# EAGLE design DFTT (EAGLE 7.4.0)

## Sheet 1 of 2
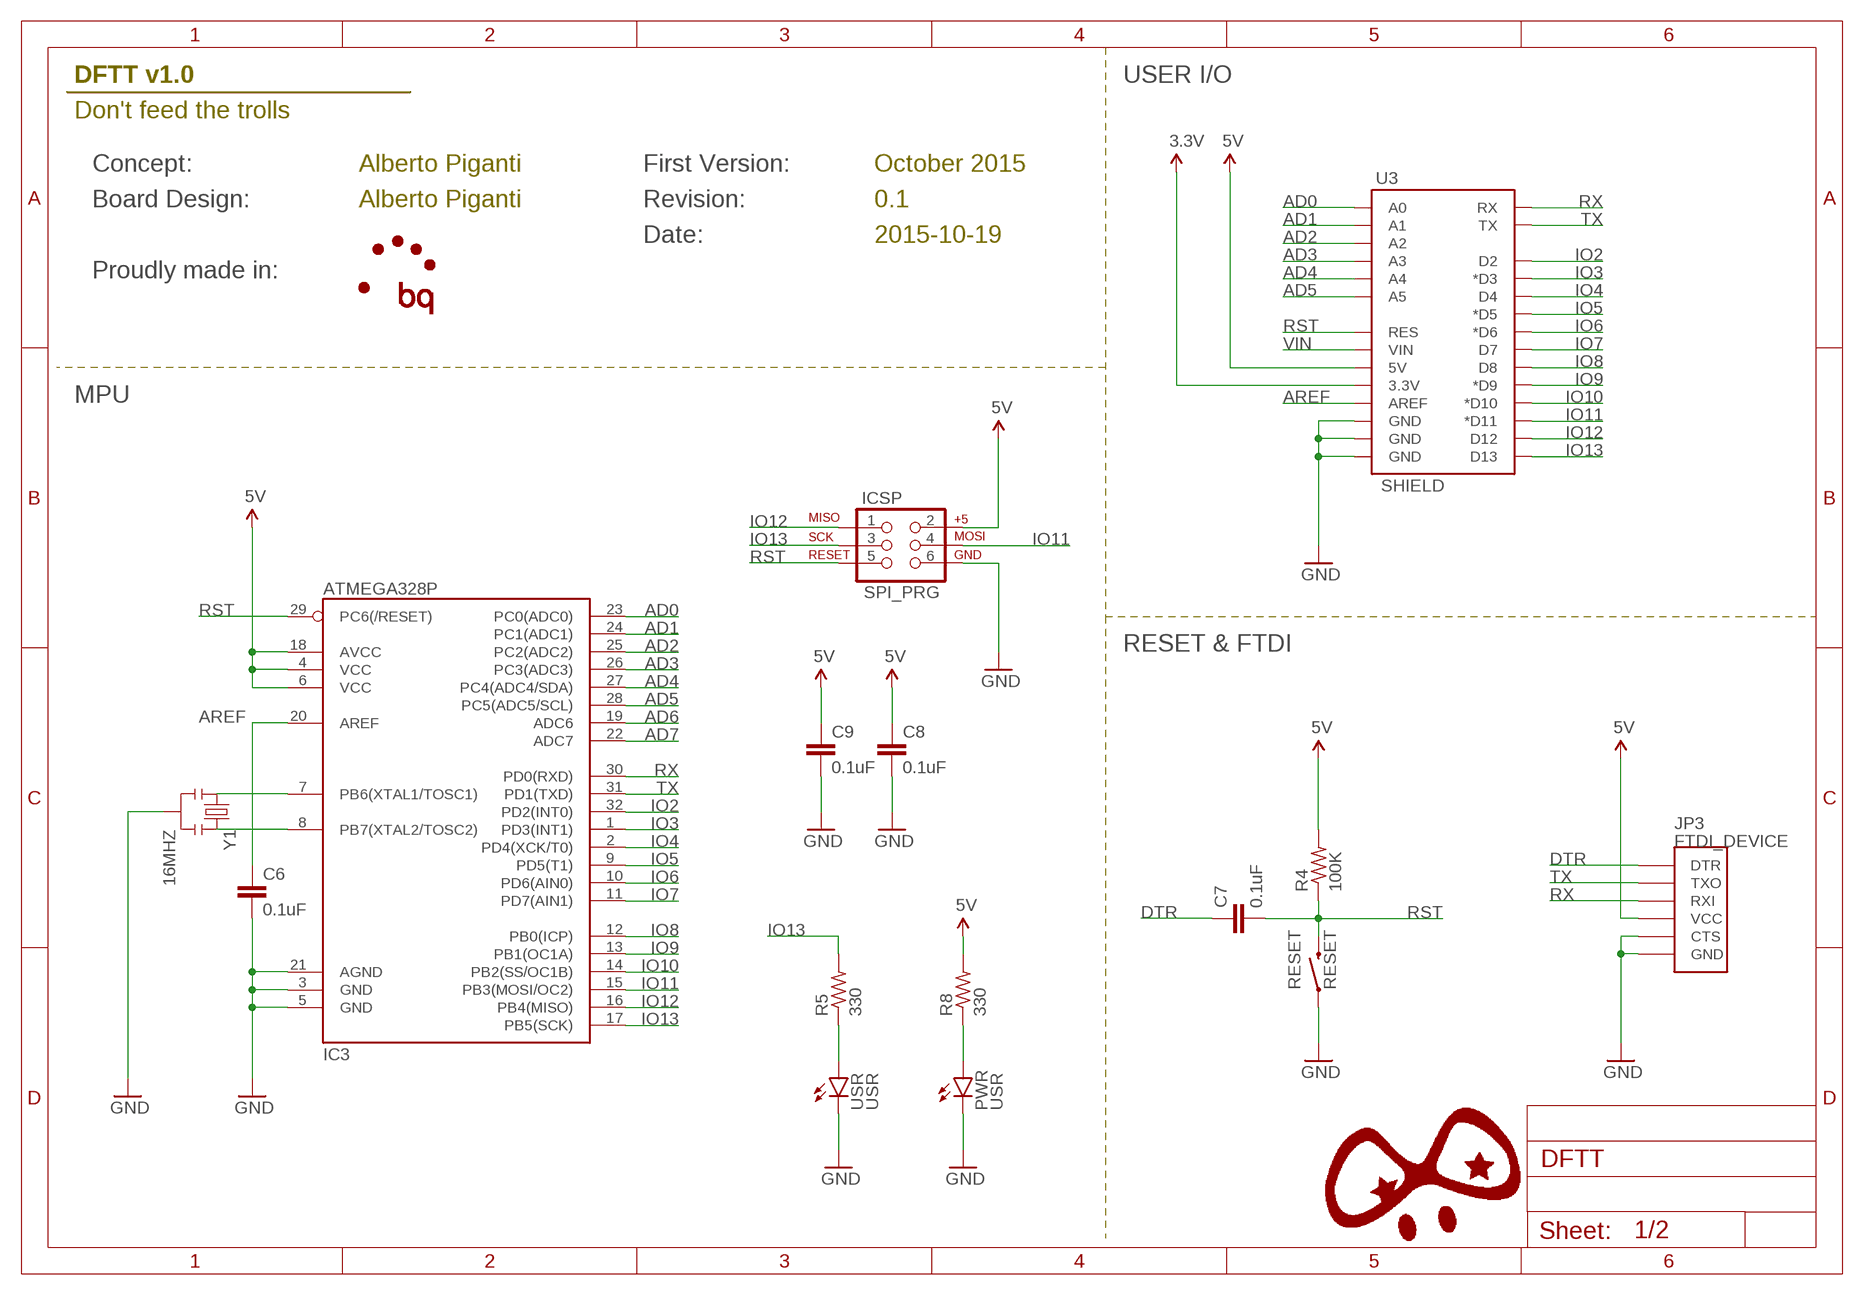
[diagram p0: schematic, sheet 1]

### Parts
C6  0.1uF  C-EUC0603  [C0603]
C7  0.1uF  C-EUC0603  [C0603]
C8  0.1uF  C-EUC0603  [C0603]
C9  0.1uF  C-EUC0603  [C0603]
IC3  ATMEGA328P  ATMEGA328_SMT  [TQFP32-08]
ICSP  SPI_PRG  AVR_SPI_PRG_6NS  [2X3-NS]
JP3  FTDI_DEVICE  [FTDI_DEVICE_SIDE]
PWR  USR  LED0603  [LED-0603]
R4  100K  R-US_R0603  [R0603]
R5  330  R-US_R0603  [R0603]
R8  330  R-US_R0603  [R0603]
RESET  RESET  SWITCH-MOMENTARY-2SMD-1101NE  [TACTILE-SWITCH-1101NE]
U3  SHIELD  ARDUINO_SHIELDNO_SILK  [DUEMILANOVE_VIAS]
USR  USR  LED0603  [LED-0603]
Y1  16MHZ  RESONATOR16MHZ  [RESONATOR-SMD]

### Nets
3.3V: U3.3.3V ; also sheet 2
5V: C8.1 C9.1 IC3.4(VCC) IC3.6(VCC) IC3.18(AVCC) ICSP.2 JP3.P$4(VCC) R4.2 R8.2 U3.5V ; also sheet 2
AD0: IC3.23(PC0(ADC0)) U3.A0
AD1: IC3.24(PC1(ADC1)) U3.A1
AD2: IC3.25(PC2(ADC2)) U3.A2
AD3: IC3.26(PC3(ADC3)) U3.A3
AD4: IC3.27(PC4(ADC4/SDA)) U3.A4
AD5: IC3.28(PC5(ADC5/SCL)) U3.A5
AD6: IC3.19(ADC6)
AD7: IC3.22(ADC7)
AREF: C6.1 IC3.20(AREF) U3.AREF
DTR: C7.1 JP3.P$1(DTR)
GND: C6.2 C8.2 C9.2 IC3.3(GND) IC3.5(GND) IC3.21(AGND) ICSP.6 JP3.P$5(CTS) JP3.P$6(GND) PWR.C RESET.1 U3.GND@0(GND) U3.GND@1(GND) U3.GND@2(GND) USR.C Y1.2 ; also sheet 2
IO2: IC3.32(PD2(INT0)) U3.D2
IO3: IC3.1(PD3(INT1)) U3.D3(*D3) ; also sheet 2
IO4: IC3.2(PD4(XCK/T0)) U3.D4
IO5: IC3.9(PD5(T1)) U3.D5(*D5) ; also sheet 2
IO6: IC3.10(PD6(AIN0)) U3.D6(*D6)
IO7: IC3.11(PD7(AIN1)) U3.D7
IO8: IC3.12(PB0(ICP)) U3.D8
IO9: IC3.13(PB1(OC1A)) U3.D9(*D9) ; also sheet 2
IO10: IC3.14(PB2(SS/OC1B)) U3.D10(*D10) ; also sheet 2
IO11: IC3.15(PB3(MOSI/OC2)) ICSP.4 U3.D11(*D11) ; also sheet 2
IO12: IC3.16(PB4(MISO)) ICSP.1 U3.D12
IO13: IC3.17(PB5(SCK)) ICSP.3 R5.2 U3.D13
N$9: R5.1 USR.A
N$10: PWR.A R8.1
N$31: IC3.7(PB6(XTAL1/TOSC1)) Y1.1
N$32: IC3.8(PB7(XTAL2/TOSC2)) Y1.3
RST: C7.2 IC3.29(PC6(/RESET)) ICSP.5 R4.1 RESET.2 U3.RES
RX: IC3.30(PD0(RXD)) JP3.P$3(RXI) U3.RX
TX: IC3.31(PD1(TXD)) JP3.P$2(TXO) U3.TX
VIN: U3.VIN ; also sheet 2

### Notes on the sheet
- DFTT v1.0 | USER I/O
- Don't feed the trolls
- Concept: | Alberto Piganti | First Version: | October 2015
- Board Design: | Alberto Piganti | Revision: | 0.1
- Date: | 2015-10-19
- Proudly made in:
- MPU
- RESET & FTDI

## Sheet 2 of 2
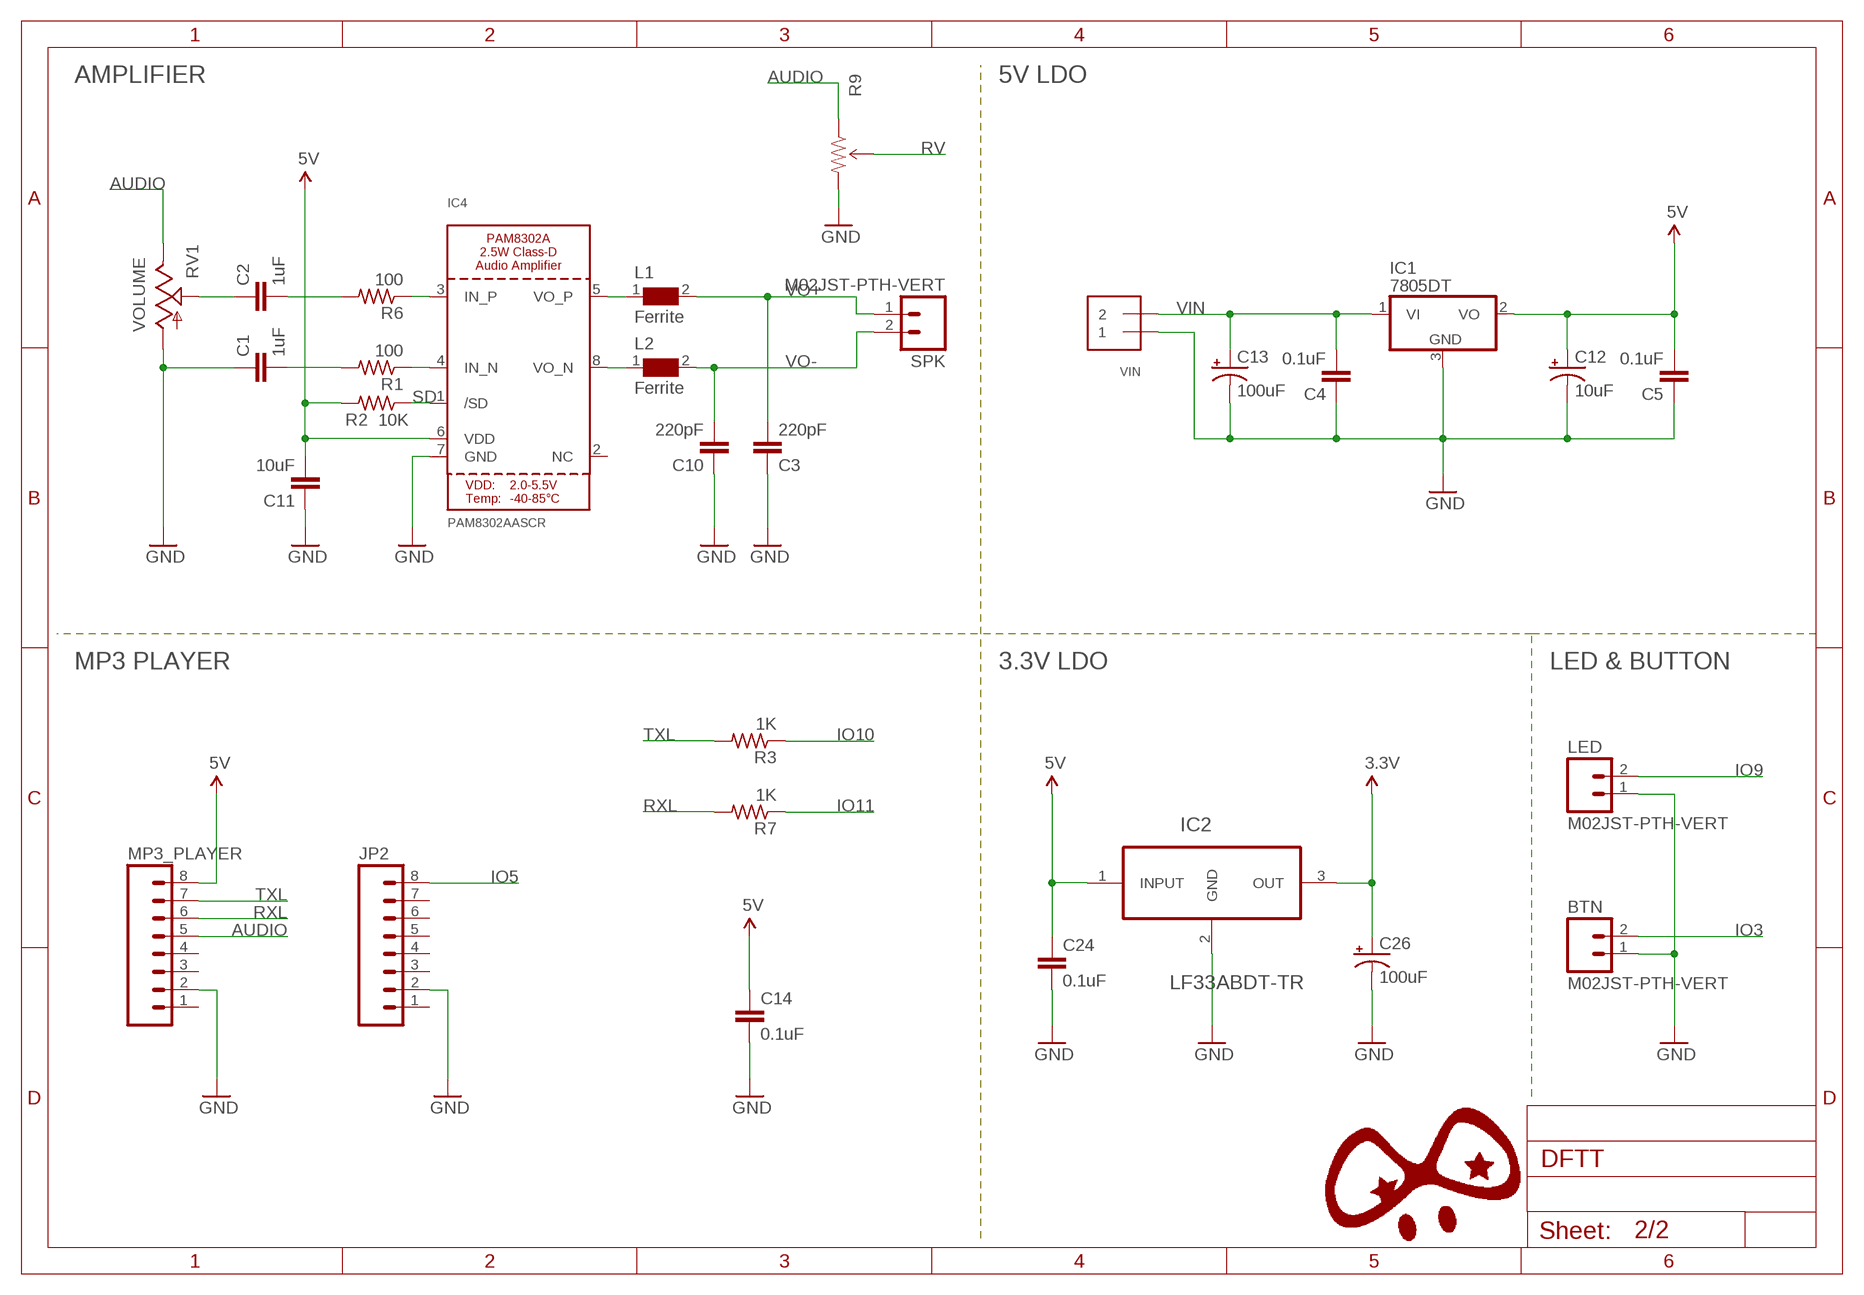
[diagram p1: schematic, sheet 2]

### Parts
BTN  M02JST-PTH-VERT  [JST-2-PTH-VERT]
C1  1uF  C-EUC0603  [C0603]
C2  1uF  C-EUC0603  [C0603]
C3  220pF  C-EUC0603  [C0603]
C4  0.1uF  C-EUC0603  [C0603]
C5  0.1uF  C-EUC0603  [C0603]
C10  220pF  C-EUC0603  [C0603]
C11  10uF  C-EUC0603  [C0603]
C12  10uF  CAP_POLD  [PANASONIC_D]
C13  100uF  CAP_POLD  [PANASONIC_D]
C14  0.1uF  CAP1210  [1210]
C24  0.1uF  CAP1210  [1210]
C26  100uF  CAP_POLD  [PANASONIC_D]
IC1  7805DT  [TO252]
IC2  LF33ABDT-TR  [TO228P972X240-3N]
IC4  PAM8302AASCR  AUDIOAMP_PAM8302A  [MSOP8_0.65MM]
JP2  M08LOCK  [1X08_LOCK]
L1  Ferrite  FERRITE-74279261_0603  [0603]
L2  Ferrite  FERRITE-74279261_0603  [0603]
LED  M02JST-PTH-VERT  [JST-2-PTH-VERT]
MP3_PLAYER  M08LOCK  [1X08_LOCK]
R1  100  R-US_R0603  [R0603]
R2  10K  R-US_R0603  [R0603]
R3  1K  R-US_R0603  [R0603]
R6  100  R-US_R0603  [R0603]
R7  1K  R-US_R0603  [R0603]
R9  TRIMPOT3362U-2  [3362U-2]
RV1  VOLUME  POTTRIM  [TRIM_POT]
SPK  M02JST-PTH-VERT  [JST-2-PTH-VERT]
VIN  TERMBLOCK_1X2  [TERMBLOCK_1X2-3.5MM]

### Nets
3.3V: C26.+ IC2.3(OUT) ; also sheet 1
5V: C5.2 C11.2 C12.+ C14.1 C24.1 IC1.2(VO) IC2.1(INPUT) IC4.6(VDD) MP3_PLAYER.8 R2.2 ; also sheet 1
AUDIO: MP3_PLAYER.5 R9.1(CCW) RV1.2(E)
GND: BTN.1 C1.1 C3.1 C4.1 C5.1 C10.1 C11.1 C12.- C13.- C14.2 C24.2 C26.- IC1.3(GND) IC2.2(GND) IC4.7(GND) JP2.2 LED.1 MP3_PLAYER.2 R9.3(CW) RV1.3(A) VIN.1 ; also sheet 1
IO3: BTN.2 ; also sheet 1
IO5: JP2.8 ; also sheet 1
IO9: LED.2 ; also sheet 1
IO10: R3.1 ; also sheet 1
IO11: R7.1 ; also sheet 1
N$1: IC4.4(IN_N) R1.1
N$2: IC4.3(IN_P) R6.1
N$3: C2.2 R6.2
N$4: C1.2 R1.2
N$5: IC4.8(VO_N) L2.1
N$6: IC4.5(VO_P) L1.1
RV: C2.1 R9.2(WIPER) RV1.1(S)
RXL: MP3_PLAYER.6 R7.2
SD: IC4.1(/SD) R2.1
TXL: MP3_PLAYER.7 R3.2
VIN: C4.2 C13.+ IC1.1(VI) VIN.2 ; also sheet 1
VO+: C3.2 L1.2 SPK.1
VO-: C10.2 L2.2 SPK.2
Unconnected: IC4.2(NC) JP2.1 JP2.3 JP2.4 JP2.5 JP2.6 JP2.7 MP3_PLAYER.1 MP3_PLAYER.3 MP3_PLAYER.4

### Notes on the sheet
- AMPLIFIER | 5V LDO
- MP3 PLAYER | 3.3V LDO | LED & BUTTON

## Library data of the parts
BTN LED SPK = SparkFun-Connectors:M02: Standard 2-pin 0.1" header. Use with - straight break away headers ( PRT-00116) - right angle break away headers (PRT-00553) - swiss pins (PRT-00743) - machine pins (PRT-00117) - female headers (PRT-00115) Molex polarized connector foot print use with: PRT-08233 with associated crimp pins and housings. 2.54_SCREWTERM for use with PRT-10571. 3.5mm Screw Terminal footprints for PRT-08084 5mm Screw Terminal footprints for use with PRT-08432
C1-C11 = resistor:C-EU: CAPACITOR, European symbol
C12 C13 C26 = SparkFun-Capacitors:CAP_POL: Capacitor Polarized These are standard SMD and PTH capacitors. Normally 10uF, 47uF, and 100uF in electrolytic and tantalum varieties. Always verify the external diameter of the through hole cap, it varies with capacity, voltage, and manufacturer. The EIA devices should be standard.
C14 C24 = SparkFun-Capacitors:CAP: Capacitor Standard 0603 ceramic capacitor, and 0.1" leaded capacitor.
IC1 = linear:78*: Positive VOLTAGE REGULATOR Source: http://cache.national.com/ds/LM/LM78L05.pdf http://www.fairchildsemi.com/ds/LM/LM7805.pdf
IC2 = STM-LF33ABDT-TR:LF33ABDT-TR: LDO, 0.45VDO, 1A, 3.3V, 1%, 3TO252; MPN: LF33ABDT-TR; OC_FARNELL: 2253503; OC_NEWARK: 26M0226; PACKAGE: DPAK; SUPPLIER: STMicroelectronics
IC3 = SparkFun-DigitalIC:ATMEGA328_SMT: 32-Pin Atmega328 part Commonly used on Arduino compatible boards Available in QFP and QFN packages TQFP is IC-09069 QFN is non-stock; PROD_ID: IC-09069
IC4 = microbuilder:AUDIOAMP_PAM8302A: PAM8302A - 2.5W Class-D Mono Audio Amplifier MSOP8 = PAM8302AASCR
ICSP = SparkFun-Connectors:AVR_SPI_PRG_6: AVR ISP 6 Pin This is the reduced ISP connector for AVR programming. Common on Arduino. This footprint will take up less PCB space and can be used with a 10-pin to 6-pin adapter such as SKU: BOB-08508 **Special note about "TEST_POINT" package. The stop mask is on the top side, so if you want your programming test points to be on the bottom of your board, make sure to place this package on the bottom side of the board. This also ensure that the orientation to program from the bottom side will be correct.
JP2 MP3_PLAYER = SparkFun-Connectors:M08: Header 8 Standard 8-pin 0.1" header. Use with straight break away headers (SKU : PRT-00116), right angle break away headers (PRT-00553), swiss pins (PRT-00743), machine pins (PRT-00117), and female headers (PRT-00115).
JP3 = SparkFun-Connectors:FTDI_DEVICE: Connector which mates to FTDI basic or FTDI cable.
L1 L2 = Honey_v2:FERRITE: SMD EMI Suppression Ferrite Beads; MPN: 74279261; OC_FARNELL: 1635684; OC_NEWARK: 08P2431; PACKAGE: IND-0603; SUPPLIER: Wuerth Elektronik
PWR USR = SparkFun-LED:LED: LEDs Standard schematic elements and footprints for 5mm, 3mm, 1206, and 0603 sized LEDs. 5mm - Spark Fun Electronics SKU : COM-00529 (and others)
R1-R8 = resistor:R-US_: RESISTOR, American symbol
R9 = SparkFun-Electromechanical:TRIMPOT: Various small potentiometers for "set-and-forget" applications
RESET = SparkFun-Electromechanical:SWITCH-MOMENTARY-2: Various NO switches- pushbuttons, reed, etc; PROD_ID: SWCH-00815
RV1 = SparkFun-Electromechanical:POT
U3 = SparkFun-Boards:ARDUINO_SHIELD: Arduino shield footprint
VIN = microbuilder:TERMBLOCK_1X2: 3.5mm Terminal block http://www.ladyada.net/library/pcb/eaglelibrary.html
Y1 = SparkFun-FreqCtrl:RESONATOR: Resonator Small SMD resonator. Used, eg, on the Arduino Pro/ Pro Mini boards. 8MHz- XTAL-08895 16MHz- XTAL-08900; PROD_ID: XTAL-08900

## Board
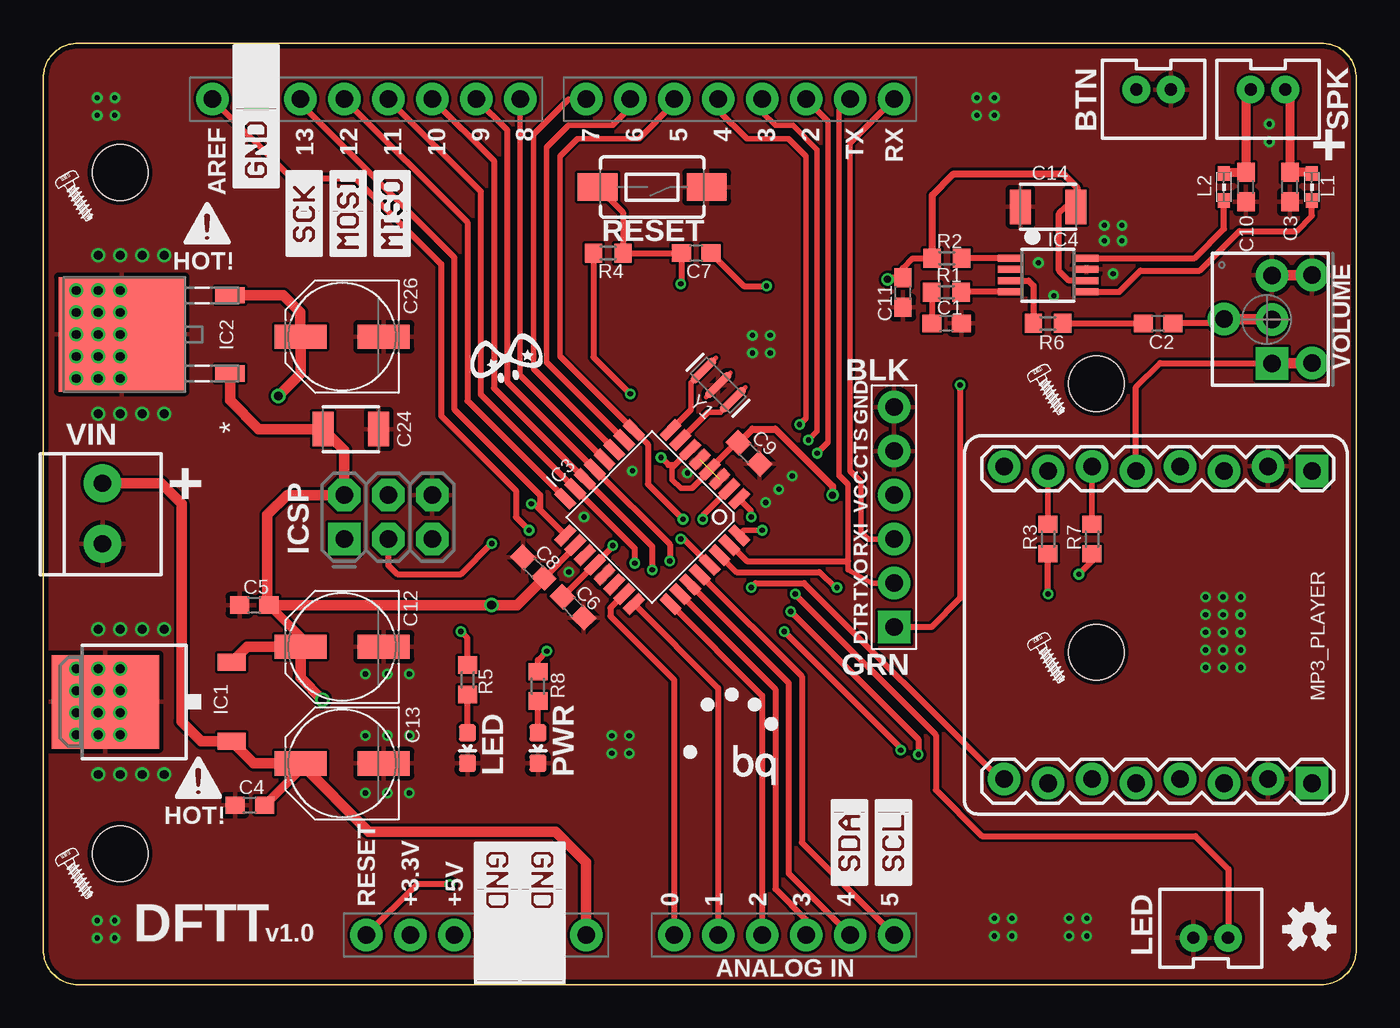
[diagram p2: board, top side]
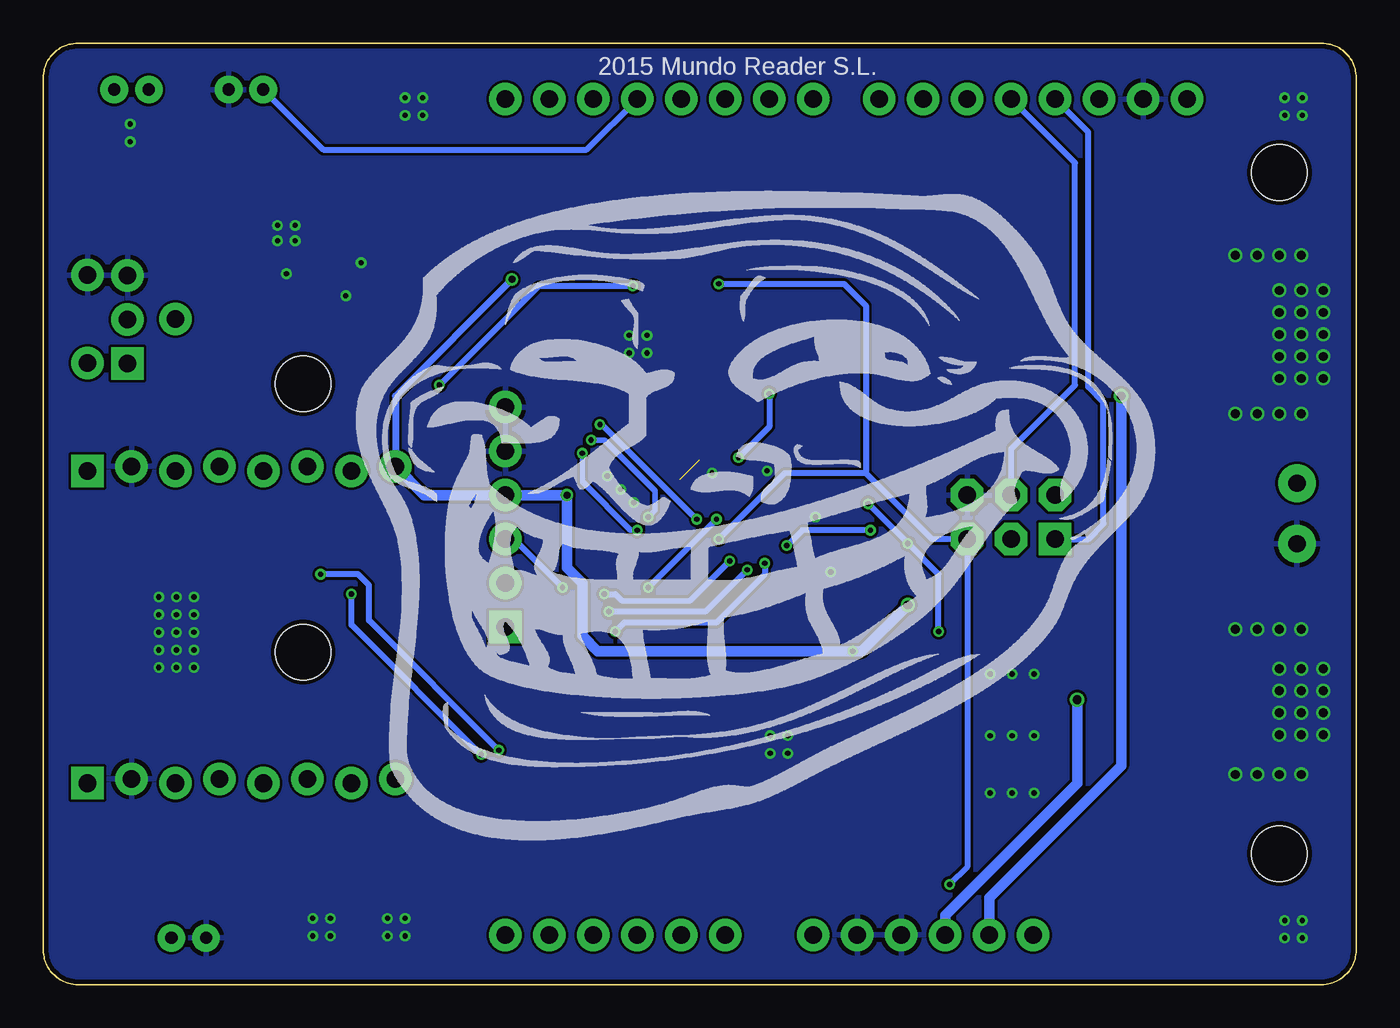
[diagram p3: board, bottom side, seen from below]

Size 75.82 x 54.34 mm. Coordinates in mm from the lower left corner, seen from the top.
Outline: 75.82,1.86 75.81,1.73 75.78,1.6 75.76,1.47 75.72,1.34 75.62,1.1 75.55,0.99 75.48,0.88 75.41,0.78 75.33,0.68 75.15,0.5 75.05,0.41 74.94,0.34 74.83,0.27 74.72,0.21 74.48,0.11 74.36,0.07 74.23,0.04 74.1,0.01 73.96,0 1.86,0 1.73,0.01 1.6,0.04 1.47,0.07 1.34,0.11 1.1,0.21 0.99,0.27 0.88,0.34 0.78,0.41 0.68,0.5 0.5,0.68 0.41,0.78 0.34,0.88 0.27,0.99 0.21,1.1 0.11,1.34 0.07,1.47 0.04,1.6 0.01,1.73 0,1.86 0,52.48 0.01,52.61 0.04,52.74 0.07,52.87 0.11,53 0.21,53.23 0.27,53.35 0.34,53.45 0.41,53.56 0.5,53.66 0.68,53.84 0.78,53.92 0.88,54 0.99,54.07 1.1,54.13 1.34,54.23 1.47,54.27 1.6,54.3 1.73,54.32 1.86,54.34 73.96,54.34 74.1,54.32 74.23,54.3 74.36,54.27 74.48,54.23 74.72,54.13 74.83,54.07 74.94,54 75.05,53.92 75.15,53.84 75.33,53.66 75.41,53.56 75.48,53.45 75.55,53.35 75.62,53.23 75.72,53 75.76,52.87 75.78,52.74 75.81,52.61 75.82,52.48 75.82,1.86
Copper layers (1*16): Top 0.035mm / dielectric 1.5mm / Bottom 0.035mm
Design rules "pighixxx_CAM_DRC_V1.0": minimum track width 6mil, minimum drill 12mil, track to track 6mil, track to pad 6mil, pad to pad 6mil, via to via 6mil, smd to smd 0mil, copper to edge 10mil, drill to drill 10mil, minimum pad ring 10mil, minimum via ring 6mil, stop-mask expansion 2mil, vias tented up to drill 100mil, thermal gap 10mil
Holes 3.2 mm at 4.43,46.88 4.43,7.56 60.82,34.69 60.82,19.19

### Footprints (pad centres in the part's own frame; a part is rotated, then mirrored left to right if it is on the bottom)
JST-2-PTH-VERT = drill 0.7 pad 1.6: 1 -1,-0.55; 2 1,-0.55
C0603 = smd 1.1 x 1: 1 -0.85,0; 2 0.85,0
PANASONIC_D = smd 3 x 1.4: + 2.4,0; - -2.4,0
1210 = smd 1.2 x 2: 1 -1.6,0; 2 1.6,0
TO252 = smd 1 x 1.6: 1 -2.28,-4.8; 2 2.28,-4.8 | smd 5.4 x 6.2: 3 0,2.5
TO228P972X240-3N = smd 0.94 x 1.702: 1 -2.261,-6.096; 3 2.261,-6.096 | smd 6.604 x 7.315: 2 0,0.152
TQFP32-08 = smd 1.27 x 0.559: 1 -4.293,2.8; 2 -4.293,2; 3 -4.293,1.2; 4 -4.293,0.4; 5 -4.293,-0.4; 6 -4.293,-1.2; 7 -4.293,-2; 8 -4.293,-2.8; 17 4.293,-2.8; 18 4.293,-2; 19 4.293,-1.2; 20 4.293,-0.4; 21 4.293,0.4; 22 4.293,1.2; 23 4.293,2; 24 4.293,2.8 | smd 0.559 x 1.27: 9 -2.8,-4.293; 10 -2,-4.293; 11 -1.2,-4.293; 12 -0.4,-4.293; 13 0.4,-4.293; 14 1.2,-4.293; 15 2,-4.293; 16 2.8,-4.293; 25 2.8,4.293; 26 2,4.293; 27 1.2,4.293; 28 0.4,4.293; 29 -0.4,4.293; 30 -1.2,4.293; 31 -2,4.293; 32 -2.8,4.293
MSOP8_0.65MM = smd 0.4 x 1.4: 1 -0.975,-2.2; 2 -0.325,-2.2; 3 0.325,-2.2; 4 0.975,-2.2; 5 0.975,2.2; 6 0.325,2.2; 7 -0.325,2.2; 8 -0.975,2.2
2X3-NS = drill 1.016 pad 1.88 square: 1 -2.54,-1.27 | drill 1.016 pad 1.88 octagon: 2 -2.54,1.27; 3 0,-1.27; 4 0,1.27; 5 2.54,-1.27; 6 2.54,1.27
1X08_LOCK = drill 1.016 pad 1.88 square: 1 0,0.127 | drill 1.016 pad 1.88: 2 2.54,-0.127; 3 5.08,0.127; 4 7.62,-0.127; 5 10.16,0.127; 6 12.7,-0.127; 7 15.24,0.127; 8 17.78,-0.127
FTDI_DEVICE_SIDE = drill 1.016 pad 1.88 square: P$1 -6.35,0 | drill 1.016 pad 1.88: P$2 -3.81,0; P$3 -1.27,0; P$4 1.27,0; P$5 3.81,0; P$6 6.35,0
0603 = smd 0.85 x 0.7: 1 -0.775,0; 2 0.775,0
LED-0603 = smd 1 x 1: A 0,-0.877; C 0,0.877
R0603 = smd 1 x 1.1: 1 -0.85,0; 2 0.85,0
3362U-2 = drill 1.016 pad 1.88 square: 1 -2.54,-0.305 | drill 1.016 pad 1.88: 2 0,-0.305; 3 2.54,-0.305
TACTILE-SWITCH-1101NE = smd 2.3 x 1.6: 1 -3.15,0; 2 3.15,0
TRIM_POT = drill 1 pad 1.88: 1 5.08,0; 2 0,2.54; 3 0,-2.54
DUEMILANOVE_VIAS = drill 1.016 pad 1.88: 3.3V 50.8,13.97; 5V 50.8,16.51; A0 50.8,29.21; A1 50.8,31.75; A2 50.8,34.29; A3 50.8,36.83; A4 50.8,39.37; A5 50.8,41.91; AREF 2.54,2.54; D2 2.54,36.83; D3 2.54,34.29; D4 2.54,31.75; D5 2.54,29.21; D6 2.54,26.67; D7 2.54,24.13; D8 2.54,20.32; D9 2.54,17.78; D10 2.54,15.24; D11 2.54,12.7; D12 2.54,10.16; D13 2.54,7.62; GND@0 50.8,19.05; GND@1 50.8,21.59; GND@2 2.54,5.08; RES 50.8,11.43; RX 2.54,41.91; TX 2.54,39.37; VIN 50.8,24.13
TERMBLOCK_1X2-3.5MM = drill 1 pad 2.184: 1 1.8,0; 2 -1.7,0
RESONATOR-SMD = smd 0.45 x 1.905: 1 -1.2,0; 2 0,0; 3 1.2,0

### Placement (x,y rotation side)
BTN  64.12,51.12 180 top
C1  52.16,38.17 180 top
C2  64.38,38.17 180 top
C3  72,46.04 90 top
C4  11.93,10.35 0 top
C5  12.18,21.91 0 top
C6  30.6,21.78 315 top
C7  37.71,42.23 180 top
C8  28.31,24.07 135 top
C9  40.76,30.67 315 top
C10  69.46,46.04 90 top
C11  49.65,39.94 90 top
C12  17.26,19.5 180 top
C13  17.26,12.77 180 top
C14  58.03,44.9 180 top
C24  17.77,32.07 0 top
C26  17.26,37.4 180 top
IC1  6.08,16.32 90 top
IC2  4.69,37.53 90 top
IC3  35.17,26.99 225 top
IC4  58.03,40.96 270 top
ICSP  19.93,26.99 0 top
JP2  73.27,11.75 180 top
JP3  49.14,26.99 90 top
L1  73.27,46.04 90 top
L2  68.19,46.04 90 top
LED  67.43,3.24 0 top
LOGO3  OSHW-LOGOS  [OSHW-LOGO-S]  73.12,3.19 0 top
MP3_PLAYER  73.27,29.78 180 top
PWR  28.56,13.65 180 top
R1  52.16,39.97 180 top
R2  52.19,41.92 180 top
R3  58.03,25.72 90 top
R4  32.63,42.23 180 top
R5  24.5,17.59 90 top
R6  58.03,38.17 0 top
R7  60.57,25.72 90 top
R8  28.56,17.21 90 top
R9  70.65,38.39 90 top
RESET  35.17,46.04 180 top
RV1  73.27,38.42 180 top
SPK  70.73,51.12 180 top
U3  7.23,53.66 270 top
U$1  [S_KICIK_GND_2]  10.4,45.99 0 top
U$2  [S_KICIK_GND_2]  28.11,8.24 180 top
U$3  [S_KICIK_GND_2]  30.7,8.24 180 top
U$4  [S_SCL]  48.12,5.78 0 top
U$5  [S_SDA]  45.58,5.78 0 top
U$6  [TROLLFACE]  60.06,5.53 0 bottom
U$7  [S_ATTENTION]  7.48,10.61 0 top
U$8  [S_MISO]  19.17,42.1 0 top
U$9  [S_MOSI]  16.63,42.1 0 top
U$10  [S_SCK]  14.09,42.1 0 top
U$11  [S_ATTENTION]  7.99,42.61 0 top
U$12  [SCREW]  1.39,44.9 0 top
U$13  [SCREW]  1.39,5.78 0 top
U$14  [SCREW]  57.52,18.23 0 top
U$15  [SCREW]  57.52,33.72 0 top
U$22  [BQ_LOGO_SMALL]  36.97,11.52 0 top
U$23  [PIGHIXXX_LOGO]  24.68,34.74 0 top
USR  24.5,13.65 180 top
VIN  3.42,27.24 270 top
Y1  38.98,34.61 135 top

### Tracks (layer width: path | path; a pad name or v marks a point on that pad's centre or on a via)
3.3V  (via drill 0.51)
  Top 0.61: IC2.3 13.86,39.79 14.85,38.8 14.85,37.42 C26.+ 14.86,35.26 v13.58,33.97
  Bottom 0.61: v13.58,33.97 13.58,12.64 21.2,5.02 U3.3.3V
5V  (via drill 0.3, 0.41, 0.51)
  Top 0.305: IC3.18 30.72,25.27 C8.1 | C9.1 40.02,31.27 IC3.4 38.49,29.67 37.45,28.64 36.82,28.64 36.31,29.15 36.31,29.83 36.48,30 IC3.6
  Top 0.356: C11.2 49.65,41.37 50.2,41.92 R2.2 | IC4.6 59.24,40.63 58.66,41.21 58.66,44.52 59.04,44.9 C14.1 | R4.2 31.78,36.22 v33.9,34.1 | v35.68,30.42 36.1,30 36.48,30 | R8.2 28.56,18.73 v29.07,19.24
  Top 0.406: C9.1 40.95,32.07 42.28,32.07 45.58,28.77 v45.58,28.26 | v48.76,40.71 48.84,40.79 C11.2 | R2.2 51.34,45.57 52.57,46.8 58.92,46.8 59.68,46.04 59.68,44.95 C14.1
  Top 0.508: C5.2 14.86,20.08 C12.+
  Top 0.61: IC1.2 11.78,19.5 C12.+ 14.86,17.71 v16.12,16.45 | C8.1 27.35,21.91 v25.9,21.91 C5.2 12.94,22 12.94,27.12 14.09,28.26 ICSP.2 17.39,30.85 C24.1 12.43,32.07 10.78,33.72 IC2.1
  Bottom 0.356: v33.9,34.1 33.9,32.2 v35.68,30.42
  Bottom 0.406: v48.76,40.71 55.49,33.97 MP3_PLAYER.8
  Bottom 0.61: v16.12,16.45 16.12,11.62 23.74,4 U3.5V | MP3_PLAYER.8 53.84,28.26 JP3.P$4 v45.58,28.26 45.58,24.07 44.69,23.18 44.69,20.13 43.8,19.24 30.6,19.24 v29.07,19.24 28.56,19.24 v25.9,21.91
AD0
  Top 0.356: IC3.23 32.75,21.75 32.75,21.27 36.44,17.59 U3.A0
AD1
  Top 0.356: IC3.24 38.98,17.11 U3.A1
AD2
  Top 0.356: IC3.25 41.52,16.68 U3.A2
AD3
  Top 0.356: IC3.26 42.28,17.05 42.28,5.53 44.06,3.75 U3.A3
AD4
  Top 0.356: IC3.27 43.04,17.42 43.04,6.42 U3.A4
AD5
  Top 0.356: IC3.28 43.8,17.79 43.8,8.19 U3.A5 49.52,2.48
AREF  (via drill 0.3)
  Top 0.305: C6.1 IC3.20
  Top 0.356: U3.AREF 14.34,46.55 18.02,46.55 22.98,41.59 22.98,32.83 27.29,28.51 27.29,26.99 v28.06,26.23 | v32.88,25.34 32.88,25.27 IC3.20
  Bottom 0.356: v28.06,26.23 31.99,26.23 v32.88,25.34
AUDIO
  Top 0.356: MP3_PLAYER.5 63.11,34.48 64.5,35.88 RV1.2
  Top 0.61: R9.1 73.24,35.85 RV1.2
DTR  (via drill 0.3)
  Top 0.356: C7.1 40.46,40.32 v41.77,40.32 | v52.95,34.61 52.95,22.29 51.3,20.64 JP3.P$1
  Bottom 0.356: v41.77,40.32 47.23,40.32 v52.95,34.61
GND  (via drill 0.3, 0.51)  (1 unrouted)
  Top 0.61: R9.3 73.24,40.93 RV1.3
  other vias: 37.2,29.53 61.79,41.04 61.28,42.94 62.3,42.94 62.3,43.83 61.28,43.83 58.36,39.77 57.47,41.67 70.8,49.67 70.8,48.66 34.02,29.66 31.23,26.99 30.34,23.81 60.26,3.82 59.25,3.82 59.25,2.81 60.26,2.81 55.95,3.82 54.93,3.82 54.93,2.81 55.95,2.81 67.12,22.37 67.12,21.35 67.12,20.33 67.12,19.32 67.12,18.3 68.14,22.37 68.14,21.35 68.14,20.33 68.14,19.32 68.14,18.3 69.15,18.3 69.15,19.32 69.15,20.33 69.15,21.35 69.15,22.37 53.91,51.2 53.91,50.18 54.93,50.18 54.93,51.2 3.11,51.2 3.11,50.18 4.13,51.2 4.13,50.18 3.11,3.7 3.11,2.68 4.13,2.68 4.13,3.7 32.83,14.37 33.85,14.37 33.85,13.35 32.83,13.35 40.96,37.48 40.96,36.46 41.98,36.46 41.98,37.48 21.15,11.06 19.88,11.06 18.61,11.06 18.61,14.37 19.88,14.37 21.15,14.37 21.15,17.92 19.88,17.92 18.61,17.92 43.25,29.35 42.48,28.59 41.72,27.83 1.89,40.07 3.16,40.07 1.89,38.8 3.16,38.8 1.89,37.53 3.16,37.53 3.16,36.26 1.89,36.26 1.89,34.99 3.16,34.99 4.43,40.07 4.43,38.8 4.43,37.53 4.43,36.26 4.43,34.99 4.43,42.1 3.16,42.1 4.43,32.96 3.16,32.96 5.7,32.96 5.7,42.1 5.7,20.51 4.43,20.51 3.16,20.51 4.43,18.23 4.43,16.96 4.43,15.69 4.43,14.42 4.43,12.13 5.7,12.13 3.16,12.13 3.16,14.42 3.16,15.69 3.16,16.96 3.16,18.23 1.89,18.23 1.89,16.96 1.89,15.69 1.89,14.42 6.97,20.51 6.97,12.13 6.97,32.96 6.97,42.1
  pour Top: -1.66,54.93 -1.66,-0.95 77.08,-0.95 77.08,54.93
  pour Bottom: -2.04,55.95 -2.04,-1.33 78.22,-1.33 78.22,55.95
IO2  (via drill 0.3)
  Top 0.305: U3.D2 45.33,49.85 45.33,31.31 v44.69,30.67 | v41.52,26.23 40.48,26.23 IC3.32
  Bottom 0.305: v44.69,30.67 44.69,29.02 41.9,26.23 v41.52,26.23
IO3  (via drill 0.3)
  Top 0.305: U3.D3 41.52,50.36 42.28,49.6 43.3,49.6 44.69,48.2 44.69,31.94 v44.18,31.43 | v40.88,26.99 40.88,27.35 IC3.1
  Bottom 0.305: v44.18,31.43 43.42,31.43 40.5,28.51 40.5,27.37 v40.88,26.99
  Bottom 0.356: BTN.2 59.65,48.2 44.44,48.2 U3.D3
IO4  (via drill 0.3)
  Top 0.305: U3.D4 38.98,50.48 40.63,48.83 43.04,48.83 44.06,47.82 44.06,32.7 v43.68,32.32 | v38.09,26.86 38.09,27.08 IC3.2
  Bottom 0.305: v43.68,32.32 43.55,32.32 v38.09,26.86
IO5  (via drill 0.3)
  Top 0.305: IC3.9 29.83,36.28 29.83,47.82 30.85,48.83 34.41,48.83 36.44,50.87 U3.D5
  Top 0.356: v40.88,22.93 41.14,23.18 43.93,23.18 55.23,11.88 JP2.8 | IC3.9 34.91,31.2 34.91,28.89 v36.95,26.86
  Bottom 0.356: v36.95,26.86 v40.88,22.93
IO6
  Top 0.305: IC3.10 29.07,35.91 29.07,48.33 30.34,49.6 32.88,49.6 33.9,50.61 U3.D6
IO7
  Top 0.305: IC3.11 28.31,35.54 28.31,49.09 30.34,51.12 U3.D7
IO8
  Top 0.305: U3.D8 27.55,35.18 IC3.12
IO9  (via drill 0.3)
  Top 0.356: U3.D9 26.79,49.34 26.79,34.81 IC3.13 36.18,25.41 v36.18,24.45 | v43.42,22.54 51.55,14.42 51.55,11.24 54.22,8.57 66.54,8.57 68.44,6.67 68.44,2.71 LED.2
  Bottom 0.356: v43.42,22.54 42.79,22.54 42.41,22.16 38.47,22.16 v36.18,24.45
IO10  (via drill 0.3)
  Top 0.356: U3.D10 26.02,47.56 26.02,34.44 IC3.14 35.17,25.29 v35.17,23.94 | v43.17,21.53 50.53,14.16 v50.53,13.27 | v58.03,22.54 R3.1
  Bottom 0.356: v35.17,23.94 37.58,21.53 v43.17,21.53 | v50.53,13.27 58.03,20.77 v58.03,22.54
IO11  (via drill 0.3)
  Top 0.356: U3.D11 25.26,45.79 25.26,34.07 IC3.15 34.15,25.18 v34.15,24.32 | v42.79,20.39 49.52,13.65 v49.52,13.53 | v59.81,23.69 60.57,24.45 R7.1
  Bottom 0.356: ICSP.4 19.93,30.93 16.24,34.61 16.24,47.44 U3.D11 | v34.15,24.32 34.15,23.69 36.95,20.89 42.28,20.89 v42.79,20.39 | v49.52,13.53 57.01,21.02 57.01,23.05 57.65,23.69 v59.81,23.69
IO12
  Top 0.356: U3.D12 24.5,44.01 24.5,33.7 IC3.16
  Bottom 0.356: ICSP.1 15.48,25.72 14.59,26.61 14.59,33.59 15.48,34.48 15.48,49.21 U3.D12
IO13  (via drill 0.3)
  Top 0.356: 28.69,27.4 28.69,28.26 23.74,33.21 23.74,41.98 14.85,50.87 U3.D13 | 28.69,27.4 IC3.17 | ICSP.3 19.93,24.2 20.44,23.69 24.12,23.69 v25.9,25.47 | v28.18,27.75 28.33,27.75 28.69,27.4 | R5.2 24.5,20 v24.12,20.39
  Bottom 0.356: v28.18,27.75 v25.9,25.47 24.12,23.69 v24.12,20.39
N$1
  Top 0.356: IC4.4 53.03,39.98 R1.1
N$2
  Top 0.305: 57.19,38.43 R6.1
  Top 0.356: IC4.3 56.9,40.63 57.19,40.35 57.19,38.43
N$3
  Top 0.356: R6.2 C2.2
N$4
  Top 0.356: R1.2 C1.2
N$5
  Top 0.356: IC4.8 66.5,41.93 68.19,43.63 L2.1
N$6
  Top 0.356: IC4.5 62.13,39.98 63.36,41.21 66.79,41.21 69.08,43.5 72.38,43.5 73.27,44.39 L1.1
N$9
  Top 0.356: USR.A R5.1
N$10
  Top 0.356: PWR.A R8.1
N$31
  Top 0.305: IC3.7 38.39,33.04 39.11,33.04
N$32
  Top 0.305: IC3.8 37.41,33.19 37.41,34.74
RST  (via drill 0.3)
  Top 0.356: RESET.2 33.48,44.58 R4.1 C7.2 36.86,40.49 v36.82,40.45 | v23.48,5.78 21.58,5.78 U3.RES | v36.82,25.72 37,25.72 IC3.29
  Bottom 0.356: v23.48,5.78 22.47,6.8 ICSP.5 24.5,25.72 28.31,29.53 | 28.31,29.53 33.01,29.53 v36.82,25.72 | v36.82,40.45 29.58,40.45 28.31,39.18 28.31,29.53
RV
  Top 0.356: RV1.1 67.93,38.17 C2.1
  Top 0.61: R9.2 68.21,38.39 RV1.1
RX  (via drill 0.3)
  Top 0.305: U3.RX 46.6,48.58 46.6,29.66 47.23,29.02 47.23,26.1 47.61,25.72 JP3.P$3
  Top 0.356: IC3.30 40.04,23.81 44.82,23.81 45.71,22.93 v45.84,22.93
  Bottom 0.305: v45.84,22.93 48.63,25.72 JP3.P$3
RXL
  Top 0.305: MP3_PLAYER.6 R7.2
SD
  Top 0.356: IC4.1 53.05,41.93 R2.1
TX
  Top 0.305: U3.TX 45.96,50.48 45.96,29.4 46.47,28.89 46.47,24.45 46.47,23.94 47.87,23.18 JP3.P$2 | IC3.31 39.71,25.37
  Top 0.356: 39.71,25.37 40.63,24.45 46.47,24.45
TXL
  Top 0.305: MP3_PLAYER.7 R3.2
VIN
  Top 0.508: C13.+ 14.86,12.44 C4.2
  Top 0.61: VIN.2 6.8,28.94 7.99,27.75 7.99,15.18 9.13,14.04 IC1.1 12.16,12.77 C13.+ 18.8,8.83 29.58,8.83 31.36,7.05 U3.VIN
VO+
  Top 0.508: SPK.1 72,51.4 C3.2 73.19,46.89 L1.2
VO-
  Top 0.508: SPK.2 69.46,51.4 C10.2 68.26,46.89 L2.2

### Text on the board
tNames: AREF | 13 | 12 | 11 | 10 | 9 | 8 | 7 | 6 | 5 | 4 | 3 | 2 | TX | RX | + | HOT! | VOLUME | + | LED | HOT! | RESET | +3.3V | +5V | 0 | 1 | 2 | 3 | 4 | 5 | DFTT | v1.0 | ANALOG IN
bNames: 2015 Mundo Reader S.L.